# EAGLE design Radio86RK-I2C (EAGLE 7.7.0)
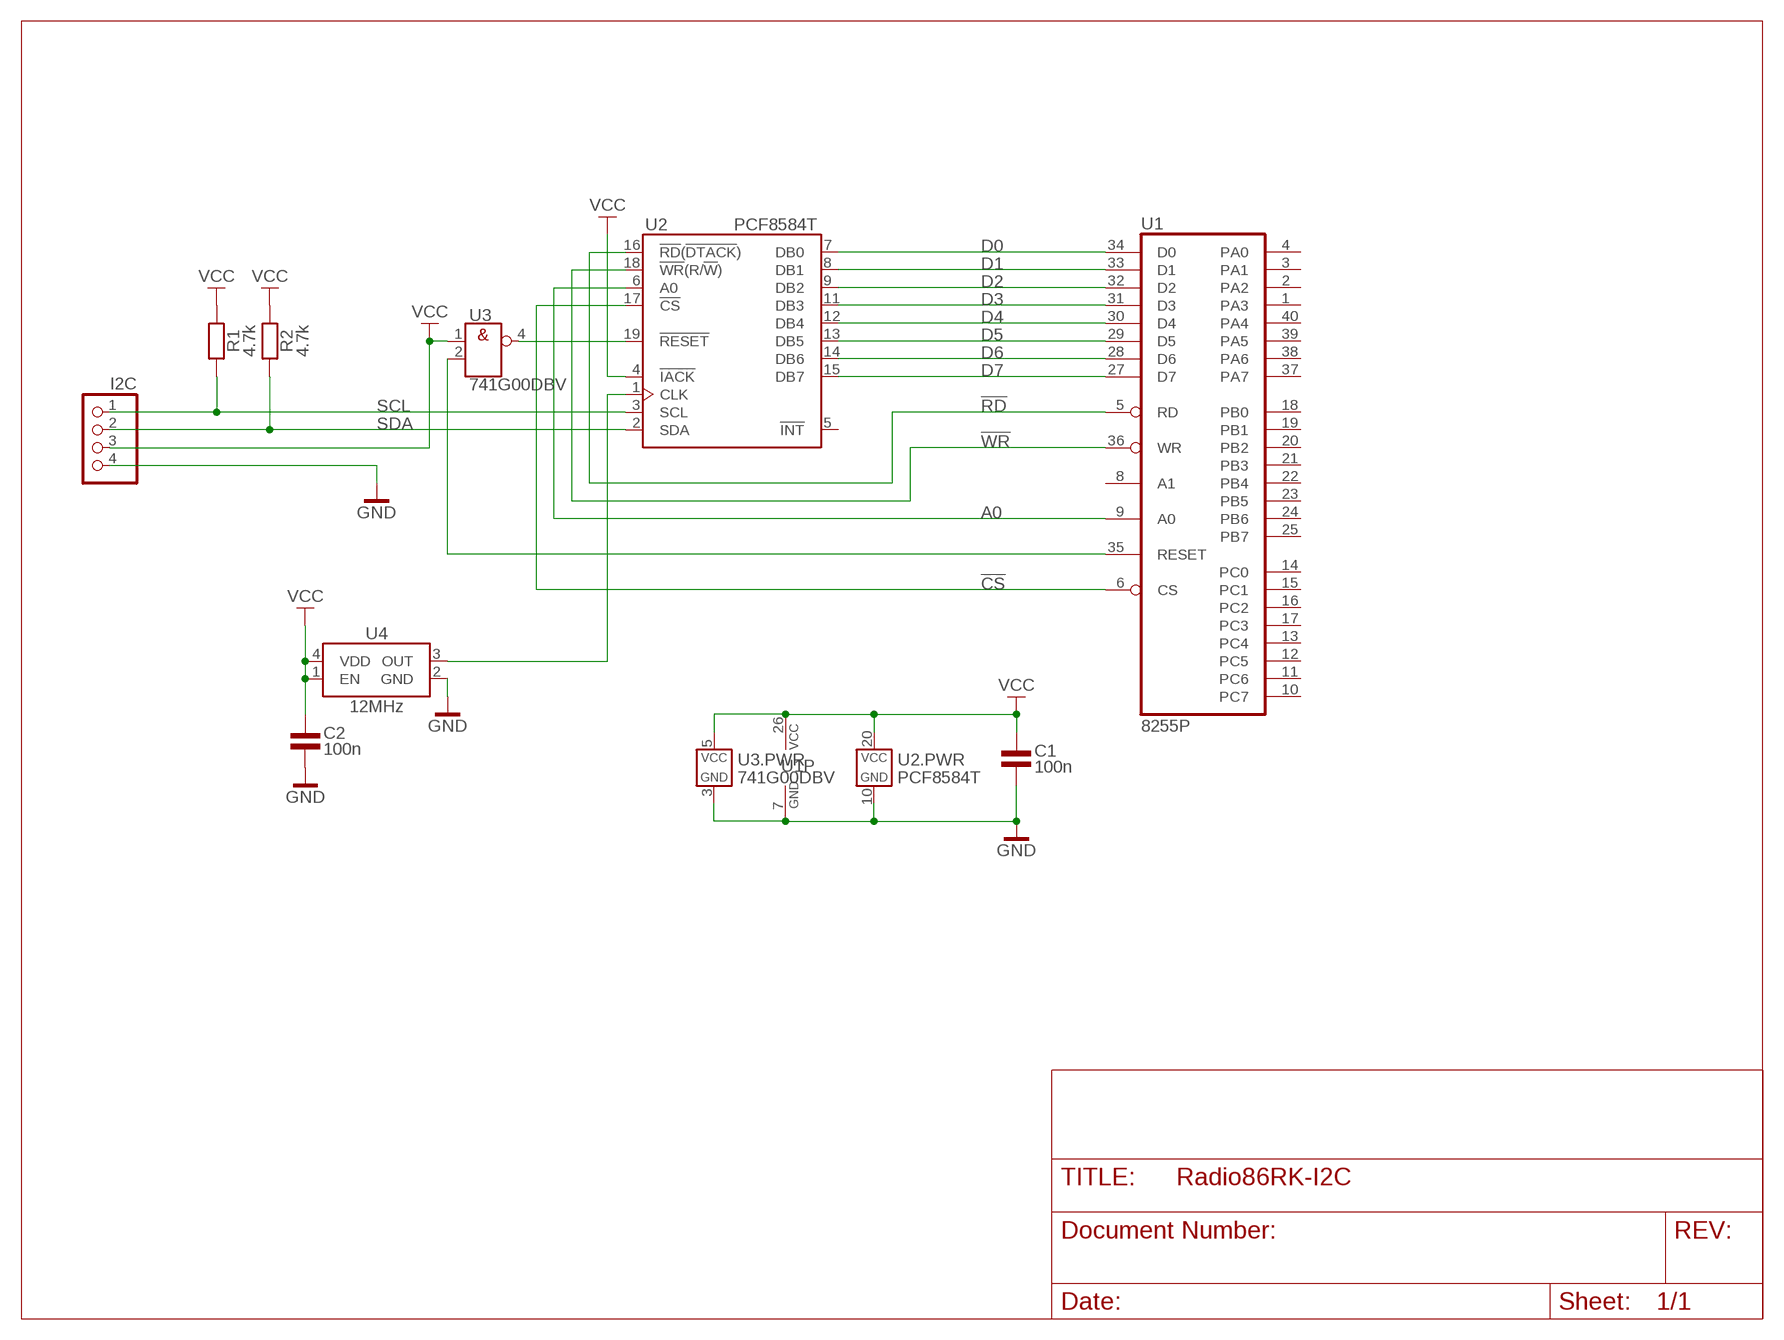
[diagram p0: schematic, sheet 1]

## Parts
C1  100n  CAPACITOR_SMD0805  [0805@1]
C2  100n  CAPACITOR_SMD0805  [0805@1]
I2C  PINHD-1X4  [1X04]
R1  4.7k  RESISTOR0805  [0805]
R2  4.7k  RESISTOR0805  [0805]
U1  8255P  [DIP40W]
U2  PCF8584T  [SO20W]
U3  741G00DBV  [SOT23-5]
U4  12MHz  XT_5X7  [XT_5X7]

## Nets
!CS: U1.6(CS) U2.17(!CS)
!RD: U1.5(RD) U2.16(!RD!(!DTACK!))
!WR: U1.36(WR) U2.18(!WR!(R/!W!))
A0: U1.9(A0) U2.6(A0)
D0: U1.34(D0) U2.7(DB0)
D1: U1.33(D1) U2.8(DB1)
D2: U1.32(D2) U2.9(DB2)
D3: U1.31(D3) U2.11(DB3)
D4: U1.30(D4) U2.12(DB4)
D5: U1.29(D5) U2.13(DB5)
D6: U1.28(D6) U2.14(DB6)
D7: U1.27(D7) U2.15(DB7)
GND: C1.1 C2.1 I2C.4 U1.7(GND) U2.10(GND) U3.3(GND) U4.2(GND)
N$1: U2.19(!RESET) U3.4(Y)
N$2: U2.1(CLK) U4.3(OUT)
N$3: U1.35(RESET) U3.2(B)
SCL: I2C.1 R1.1 U2.3(SCL)
SDA: I2C.2 R2.1 U2.2(SDA)
VCC: C1.2 C2.2 I2C.3 R1.2 R2.2 U1.26(VCC) U2.4(!IACK) U2.20(VCC) U3.1(A) U3.5(VCC) U4.1(EN) U4.4(VDD)
Unconnected: U1.1(PA3) U1.2(PA2) U1.3(PA1) U1.4(PA0) U1.8(A1) U1.10(PC7) U1.11(PC6) U1.12(PC5) U1.13(PC4) U1.14(PC0) U1.15(PC1) U1.16(PC2) U1.17(PC3) U1.18(PB0) U1.19(PB1) U1.20(PB2) U1.21(PB3) U1.22(PB4) U1.23(PB5) U1.24(PB6) U1.25(PB7) U1.37(PA7) U1.38(PA6) U1.39(PA5) U1.40(PA4) U2.5(!INT)

## Library data of the parts
C1 C2 = 1_eagle_lib:CAPACITOR_SMD
I2C = pinhead:PINHD-1X4: PIN HEADER
R1 R2 = 1_eagle_lib:RESISTOR: Vishay CMF Metal Film Resistors, Axial, Industrial, Precision
U1 = 1_eagle_lib:8255: MICROCOMPUTER/PERIPHERAL DEVICE
U2 = 1_eagle_lib:PCF8584: The PCF8584 serves as an interface between most standard parallel-bus microcontrollers/microprocessors and the serial I2C-bus.
U3 = 1_eagle_lib:74*1G00: Single2-Input Positive-NANDGate
U4 = 1_eagle_lib:XT: Crystal oscillator

## Board
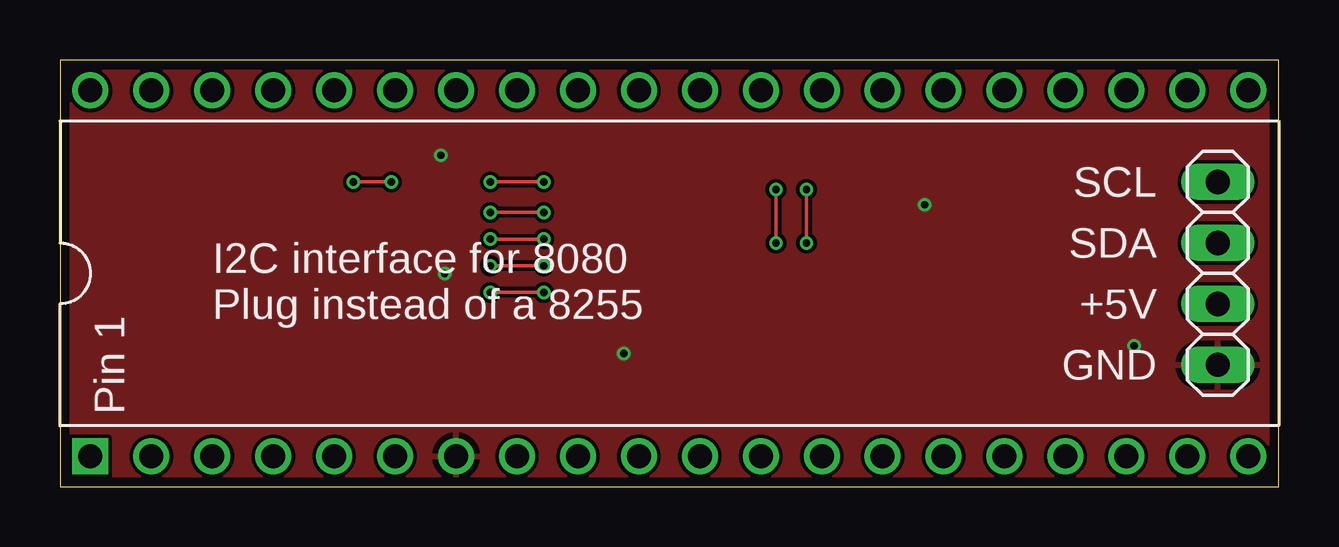
[diagram p1: board, top side]
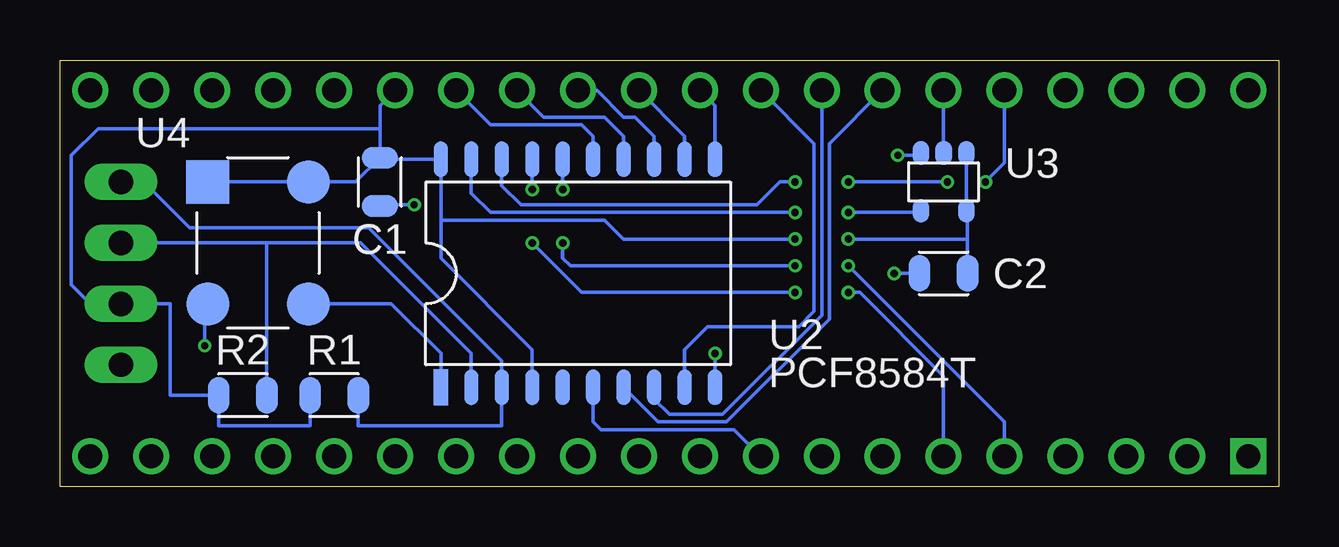
[diagram p2: board, bottom side, seen from below]

Size 50.8 x 17.78 mm. Coordinates in mm from the lower left corner, seen from the top.
Outline: 0,0 50.8,0 50.8,17.78 0,17.78 0,0
Copper layers (1*16): Top 0.035559375mm / dielectric 1.6mm / Bottom 0.035559375mm
Design rules "oshpark-2layer-tented": minimum track width 6mil, minimum drill 10mil, track to track 6mil, track to pad 6mil, pad to pad 6mil, via to via 6mil, smd to smd 6mil, copper to edge 15mil, drill to drill 6mil, minimum pad ring 5mil, minimum via ring 5mil, stop-mask expansion 2.5mil, vias tented up to drill 20mil, thermal gap 10mil

### Footprints (pad centres in the part's own frame; a part is rotated, then mirrored left to right if it is on the bottom)
0805@1 = smd 0.914 x 1.524: 1 -1.003,0; 2 1.003,0
1X04 = drill 1.016 long: 1 -3.81,0; 2 -1.27,0; 3 1.27,0; 4 3.81,0
0805 = smd 0.914 x 1.524: 1 -1.003,0; 2 1.003,0
DIP40W = drill 1 square: 1 -24.13,-7.62 | drill 1: 2 -21.59,-7.62; 3 -19.05,-7.62; 4 -16.51,-7.62; 5 -13.97,-7.62; 6 -11.43,-7.62; 7 -8.89,-7.62; 8 -6.35,-7.62; 9 -3.81,-7.62; 10 -1.27,-7.62; 11 1.27,-7.62; 12 3.81,-7.62; 13 6.35,-7.62; 14 8.89,-7.62; 15 11.43,-7.62; 16 13.97,-7.62; 17 16.51,-7.62; 18 19.05,-7.62; 19 21.59,-7.62; 20 24.13,-7.62; 21 24.13,7.62; 22 21.59,7.62; 23 19.05,7.62; 24 16.51,7.62; 25 13.97,7.62; 26 11.43,7.62; 27 8.89,7.62; 28 6.35,7.62; 29 3.81,7.62; 30 1.27,7.62; 31 -1.27,7.62; 32 -3.81,7.62; 33 -6.35,7.62; 34 -8.89,7.62; 35 -11.43,7.62; 36 -13.97,7.62; 37 -16.51,7.62; 38 -19.05,7.62; 39 -21.59,7.62; 40 -24.13,7.62
SO20W = smd 0.6 x 1.5: 1 -5.715,-4.75; 2 -4.445,-4.75; 3 -3.175,-4.75; 4 -1.905,-4.75; 5 -0.635,-4.75; 6 0.635,-4.75; 7 1.905,-4.75; 8 3.175,-4.75; 9 4.445,-4.75; 10 5.715,-4.75; 11 5.715,4.75; 12 4.445,4.75; 13 3.175,4.75; 14 1.905,4.75; 15 0.635,4.75; 16 -0.635,4.75; 17 -1.905,4.75; 18 -3.175,4.75; 19 -4.445,4.75; 20 -5.715,4.75
SOT23-5 = smd 0.7 x 1: 1 -0.95,-1.2; 2 0,-1.2; 3 0.95,-1.2; 4 0.95,1.2; 5 -0.95,1.2
XT_5X7 = smd 1.803 x 1.803: 1 -2.54,-2.095; 2 2.54,-2.095; 3 2.54,2.095; 4 -2.54,2.095

### Placement (x,y rotation side)
C1  37.47,12.7 90 bottom
C2  13.97,8.89 0 bottom
I2C  48.26,8.89 270 top
R1  39.37,3.81 180 bottom
R2  43.18,3.81 180 bottom
U1  25.4,8.89 0 top
U2  29.21,8.89 0 bottom
U3  13.97,12.7 180 bottom
U4  42.55,10.16 270 bottom

### Tracks (layer width: path | path; a pad name or v marks a point on that pad's centre or on a via)
!CS  (via drill 0.3 pad 0.25)
  Top 0.152: v31.11,12.38 v31.11,10.16 | v20.16,8.1 v17.94,8.1
  Bottom 0.152: U2.17 v31.11,12.38 | v31.11,10.16 29.05,8.1 v20.16,8.1 | v17.94,8.1 17.46,8.1 13.97,4.6 U1.6
!RD  (via drill 0.3 pad 0.25)
  Top 0.152: v29.84,12.38 v29.84,10.16 | v20.16,9.21 v17.94,9.21
  Bottom 0.152: U2.16 v29.84,12.38 | v29.84,10.16 29.84,9.53 29.53,9.21 v20.16,9.21 | v17.94,9.21 11.43,2.7 U1.5
!WR  (via drill 0.3, 0.3 pad 0.25)
  Top 0.152: v12.22,12.7 v13.81,12.7 | v17.94,12.7 v20.16,12.7
  Bottom 0.152: U1.36 11.43,13.49 v12.22,12.7 | v13.81,12.7 v17.94,12.7 | v20.16,12.7 20.8,12.7 21.75,11.75 31.59,11.75 32.38,12.54 U2.18
A0
  Bottom 0.152: U1.9 22.7,2.38 28.26,2.38 28.57,2.7 U2.6
D0
  Bottom 0.152: U2.7 25.86,2.7 23.02,2.7 18.73,6.99 18.73,14.29 U1.34
D1
  Bottom 0.152: U2.8 26.04,3.65 25.4,3.02 23.18,3.02 19.05,7.14 U1.33
D2
  Bottom 0.152: U1.32 19.37,14.29 19.37,7.3 20,6.67 22.86,6.67 23.81,6.67 24.77,5.71 U2.9 24.77,4.76
D3
  Bottom 0.152: U1.31 23.5,15.88 U2.11
D4
  Bottom 0.152: U1.30 24.77,14.61 U2.12
D5
  Bottom 0.152: U2.13 26.04,14.61 26.83,15.4 27.3,15.4 28.42,16.51 U1.29
D6
  Bottom 0.152: U1.28 30.64,15.4 28.1,15.4 27.3,14.61 U2.14
D7
  Bottom 0.152: U1.27 32.86,15.08 29.05,15.08 28.57,14.61 U2.15
GND  (via drill 0.3 pad 0.25)
  Bottom 0.152: v23.5,5.56 U2.10 | v44.77,5.87 44.77,7.49 U4.2 | v15.88,13.81 15.01,13.81 U3.3 | v16.03,8.89 C2.1 | v36.04,11.75 37.41,11.75 C1.1
  pour Top: 0,17.78 50.8,17.78 50.8,0 0,0
N$1  (via drill 0.3 pad 0.25)
  Top 0.152: v20.16,11.43 v17.94,11.43
  Bottom 0.152: U2.19 33.66,12.22 32.86,11.43 v20.16,11.43 | v17.94,11.43 15.01,11.43 U3.4
N$2
  Bottom 0.152: U4.3 36.99,7.62 34.92,5.56 U2.1
N$3
  Bottom 0.152: U1.35 U3.2
SCL
  Bottom 0.152: I2C.1 47.31,12.7 45.4,10.79 37.94,10.79 32.38,5.24 U2.3 32.38,2.54 38.37,2.54 R1.1
SDA
  Bottom 0.152: 42.18,10.16 38.26,10.16 33.66,5.56 U2.2 | 42.18,10.16 I2C.2 | R2.1 42.18,10.16
VCC  (via drill 0.3 pad 0.25)
  Top 0.152: v17.94,10.32 v20.16,10.32
  Bottom 0.152: U3.1 U3.5 12.97,11.45 C2.2 12.97,10.32 v17.94,10.32 | U4.1 U4.4 38.47,12.7 C1.2 | C1.2 37.4,13.64 U2.20 34.92,11.11 | U1.26 37.47,15.88 37.47,14.92 | 34.92,11.11 34.92,9.53 31.11,5.71 U2.4 | v20.16,10.32 27.3,10.32 28.1,11.11 34.92,11.11 | 37.47,14.92 49.21,14.92 50.32,13.81 50.32,8.41 49.53,7.62 I2C.3 46.2,7.62 46.2,3.81 R2.2 44.18,2.54 40.37,2.54 R1.2 | 37.47,14.92 C1.2

### Text on the board
tPlace: SCL | I2C interface for 8080 / Plug instead of a 8255 | SDA | +5V | GND | Pin 1